# EAGLE design Bramble (EAGLE 9.6.2)
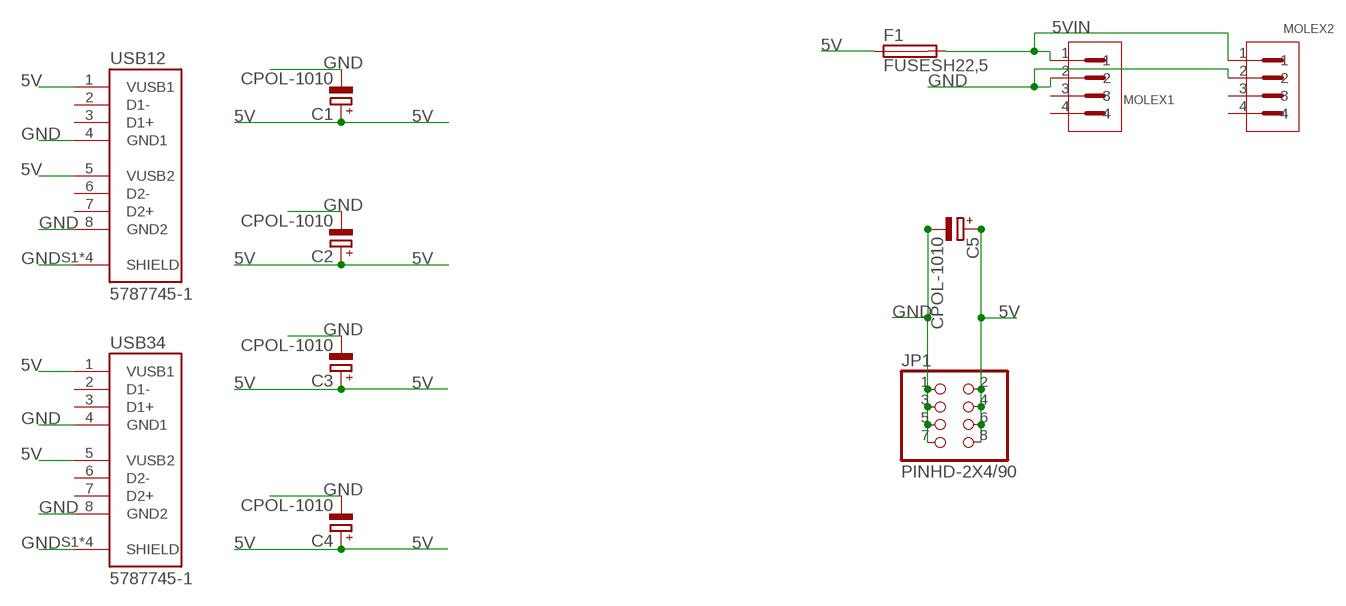
[diagram p0: schematic, sheet 1]

## Parts
C1  CPOL-1010  [153CLV-1010]
C2  CPOL-1010  [153CLV-1010]
C3  CPOL-1010  [153CLV-1010]
C4  CPOL-1010  [153CLV-1010]
C5  CPOL-1010  [153CLV-1010]
F1  FUSESH22,5  [SH22,5]
JP1  PINHD-2X4/90  [2X04/90]
MOLEX1  15244441  [MOLEX_15244441]
MOLEX2  15244441  [MOLEX_15244441]
USB12  5787745-1  [TE_5787745-1]
USB34  5787745-1  [TE_5787745-1]

## Nets
5V: C1.+ C2.+ C3.+ C4.+ C5.+ F1.1 JP1.2 JP1.4 JP1.6 JP1.8 USB12.1(VUSB1) USB12.5(VUSB2) USB34.1(VUSB1) USB34.5(VUSB2)
5VIN: F1.2 MOLEX1.1 MOLEX2.1
GND: C1.- C2.- C3.- C4.- C5.- JP1.1 JP1.3 JP1.5 JP1.7 MOLEX1.2 MOLEX2.2 USB12.4(GND1) USB12.8(GND2) USB12.S1(SHIELD) USB12.S2(SHIELD) USB12.S3(SHIELD) USB12.S4(SHIELD) USB34.4(GND1) USB34.8(GND2) USB34.S1(SHIELD) USB34.S2(SHIELD) USB34.S3(SHIELD) USB34.S4(SHIELD)
Unconnected: MOLEX1.3 MOLEX1.4 MOLEX2.3 MOLEX2.4 USB12.2(D1-) USB12.3(D1+) USB12.6(D2-) USB12.7(D2+) USB34.2(D1-) USB34.3(D1+) USB34.6(D2-) USB34.7(D2+)

## Library data of the parts
C1-C5 = cap-vishay-153clv:CPOL-1010
F1 = fuse:FUSE: Fuse; OC_FARNELL: unknown; OC_NEWARK: unknown
JP1 = Connector:PINHD-2X4: PIN HEADER; CATEGORY: CONNECTOR; SUB-CATEGORY: PIN-HEADER
MOLEX1 MOLEX2 = 15244441:15244441: Conn Disk Drive Power HDR 4 POS 5.08mm Solder RA Thru-Hole 4 Terminal 1 Port Tray Check prices <https://pricing.snapeda.com/search/part/15-24-4441/?ref=eda>; AVAILABILITY: Bad; DESCRIPTION: Connector Header Through Hole, Right Angle 4 position 0.200 (5.08mm); MF: Molex; MP: 15-24-4441; PACKAGE: None; PRICE: None
USB12 USB34 = 5787745-1:5787745-1: Conn USB 2.0 Type A RCP/RCP 4/4 POS Solder RA Thru-Hole 8 Terminal 2 Port Tray Check prices <https://pricing.snapeda.com/search/part/5787745-1/?ref=eda>; AVAILABILITY: Good; COMMENT: 5787745-1; DESCRIPTION: Conn USB 2.0 Type A RCP/RCP 4/4 POS Solder RA Thru-Hole 8 Terminal 2 Port Tray; EU_ROHS_COMPLIANCE: Compliant; MF: TE Connectivity; MP: 5787745-1; PACKAGE: None; PRICE: None; PURCHASE-URL: https://pricing.snapeda.com/search/part/5787745-1/?ref=eda

## Board
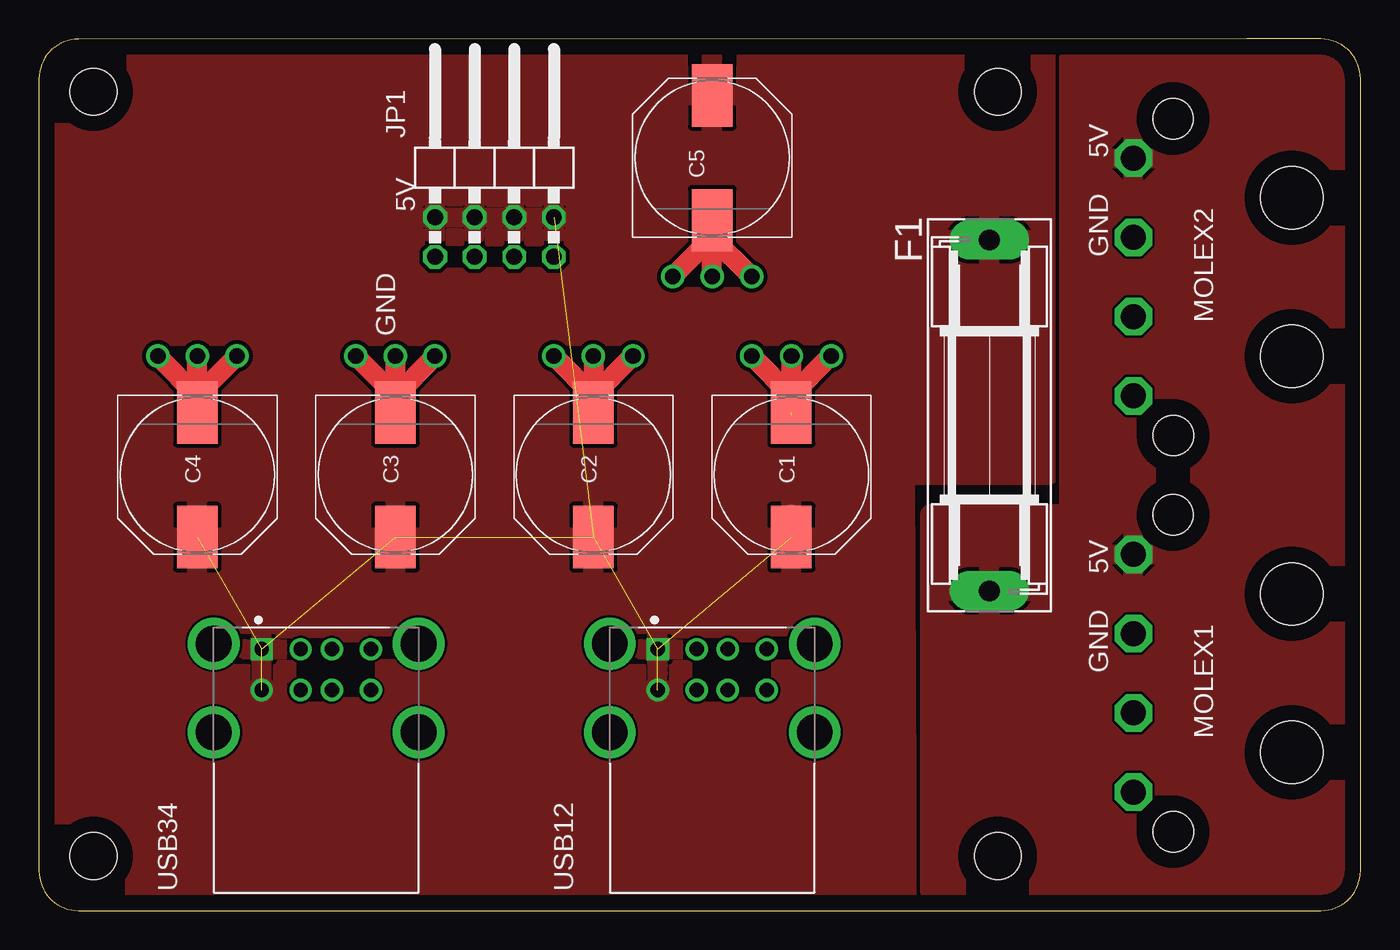
[diagram p1: board, top side]
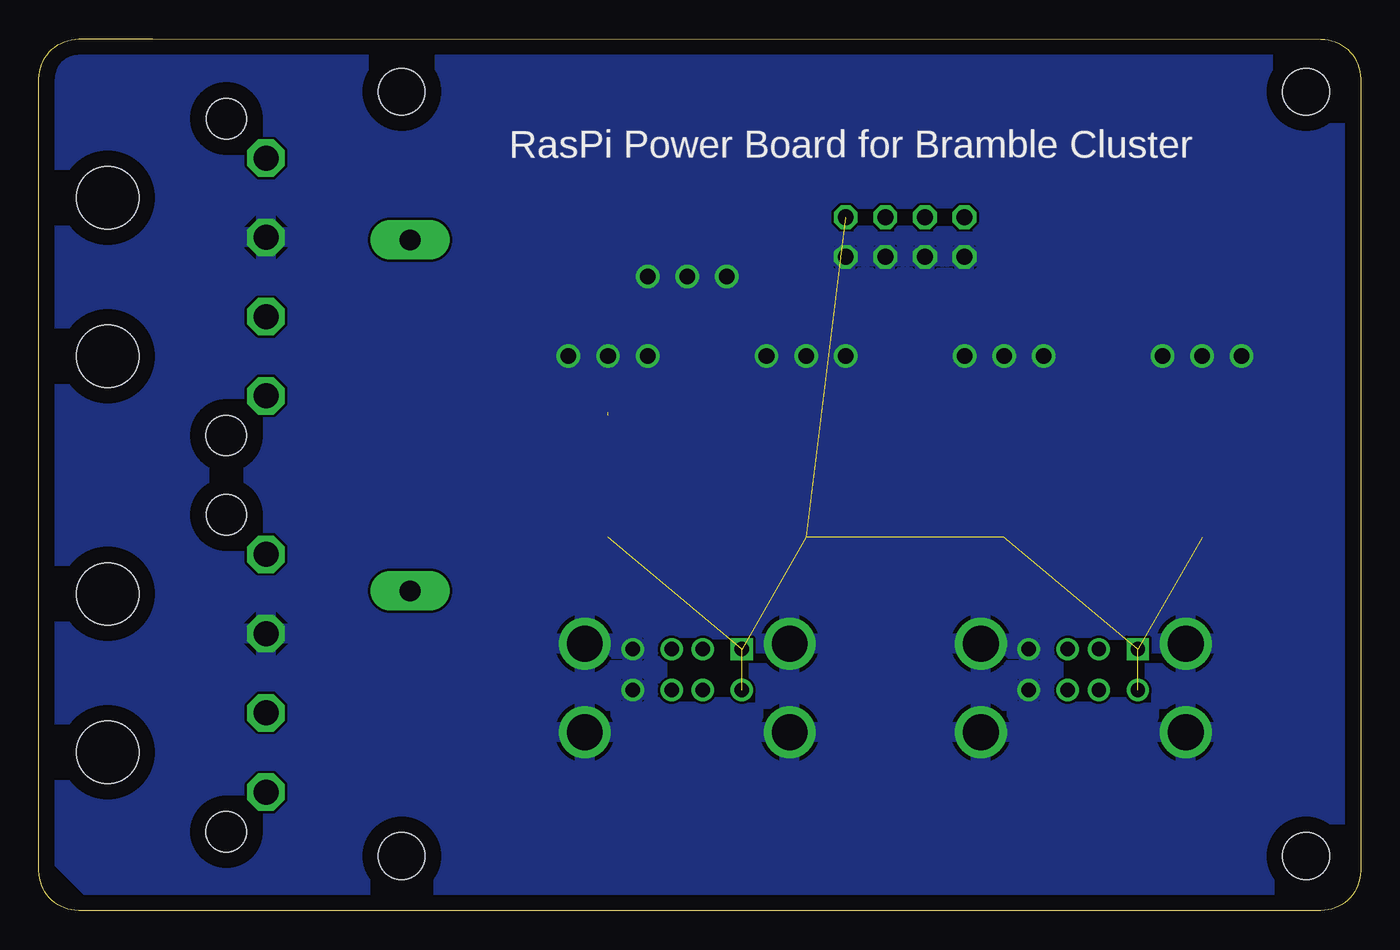
[diagram p2: board, bottom side, seen from below]

Size 84.76 x 55.88 mm. Coordinates in mm from the lower left corner, seen from the top.
Outline: 2.54,0 82.22,0 arc90 84.76,2.54 84.76,53.33 arc90 82.21,55.88 77.47,55.88 2.54,55.87 arc90 0,53.33 0,2.54 arc90 2.54,0
Copper layers (1*16): Top 0.035mm / dielectric 1.5mm / Bottom 0.035mm
Design rules "default": minimum track width 6mil, minimum drill 0.35mm, track to track 6mil, track to pad 6mil, pad to pad 6mil, via to via 6mil, smd to smd 6mil, copper to edge 40mil, drill to drill 6mil, minimum pad ring 10mil, minimum via ring 8mil, stop-mask expansion 4mil, vias tented up to drill 0mil, thermal gap 10mil
Holes 3 mm at 3.5,52.5 3.5,3.5 61.5,52.5 61.5,3.5

### Footprints (pad centres in the part's own frame; a part is rotated, then mirrored left to right if it is on the bottom)
153CLV-1010 = smd 4 x 2.6: + 4,0; - -4,0
SH22,5 = drill 1.321 pad 2.54 long: 1 -11.252,0; 2 11.252,0
2X04/90 = drill 1.016 octagon: 1 -3.81,-6.35; 2 -3.81,-3.81; 3 -1.27,-6.35; 4 -1.27,-3.81; 5 1.27,-6.35; 6 1.27,-3.81; 7 3.81,-6.35; 8 3.81,-3.81
MOLEX_15244441 = drill 1.6 octagon: 1 -7.6,-6; 2 -2.52,-5.999; 3 2.562,-6; 4 7.642,-5.999 | hole 2.59: -10.14,-3.461; 10.181,-3.46 | hole 3.99: -5.06,4.158; 5.098,4.157
TE_5787745-1 = drill 0.92 square: 1 -3.5,5.33 | drill 0.92: 2 -1,5.33; 3 1,5.33; 4 3.5,5.33; 5 -3.5,2.71; 6 -1,2.71; 7 1,2.71; 8 3.5,2.71 | drill 2.3: S1 -6.57,5.68; S2 -6.57,0; S3 6.57,5.68; S4 6.57,0

### Placement (x,y rotation side)
C1  48.26,27.94 270 top
C2  35.56,27.94 270 top
C3  22.86,27.94 270 top
C4  10.16,27.94 270 top
C5  43.18,48.26 90 top
F1  60.96,31.75 270 top
JP1  29.21,48.26 0 top
MOLEX1  76.2,15.24 270 top
MOLEX2  76.2,40.64 270 top
USB12  43.18,11.43 0 top
USB34  17.78,11.43 0 top

### Tracks (layer width: path | path; a pad name or v marks a point on that pad's centre or on a via)
5V  (8 unrouted)
  Top 1.27: 48.26,25.4 C1.+
  pour Top (isolate 0.254, rank 2): 1.27,3.81 3.81,1.27 55.7,1.27 55.58,27.94 64.77,27.94 64.77,54.61 3.81,54.61 1.27,52.07
  pour Top: 33.02,25.4 33.02,8.89 53.34,8.89 53.34,25.4
  pour Top: 7.62,25.4 7.62,8.89 27.94,8.89 27.94,25.4
5VIN
  pour Top: 66.04,54.61 66.04,25.4 57.15,25.4 57.15,1.27 82.55,1.27 83.82,2.54 83.82,53.34 82.55,54.61
GND  (via drill 1)  (1 unrouted)
  Top 1.27: v10.16,35.56 C4.- 10.16,33.02 | v7.62,35.56 10.16,33.02 | 10.16,33.02 v12.7,35.56 | v22.86,35.56 C3.- 22.86,33.02 | 22.86,33.02 v20.32,35.56 | 22.86,33.02 v25.4,35.56 | v35.56,35.56 C2.- 35.56,33.02 | v33.02,35.56 35.56,33.02 | v38.1,35.56 35.56,33.02 | v43.18,40.64 C5.- 43.18,43.18 | v40.64,40.64 43.18,43.18 | v45.72,40.64 43.18,43.18 | 48.26,33.02 v48.26,35.56 | v45.72,35.56 48.26,33.02 | v50.8,35.56 48.26,33.02 | 48.26,33.02 48.26,31.75
  pour Bottom: 2.54,1.27 81.28,1.27 83.82,3.81 83.82,53.34 82.55,54.61 3.81,54.61 1.27,52.07 1.27,2.54

### Text on the board
bPlace: RasPi Power Board for Bramble Cluster
tNames: 5V | 5V | GND | GND | 5V | GND